# EAGLE design doodle with clock5  atmega328 3 (EAGLE 6.2)
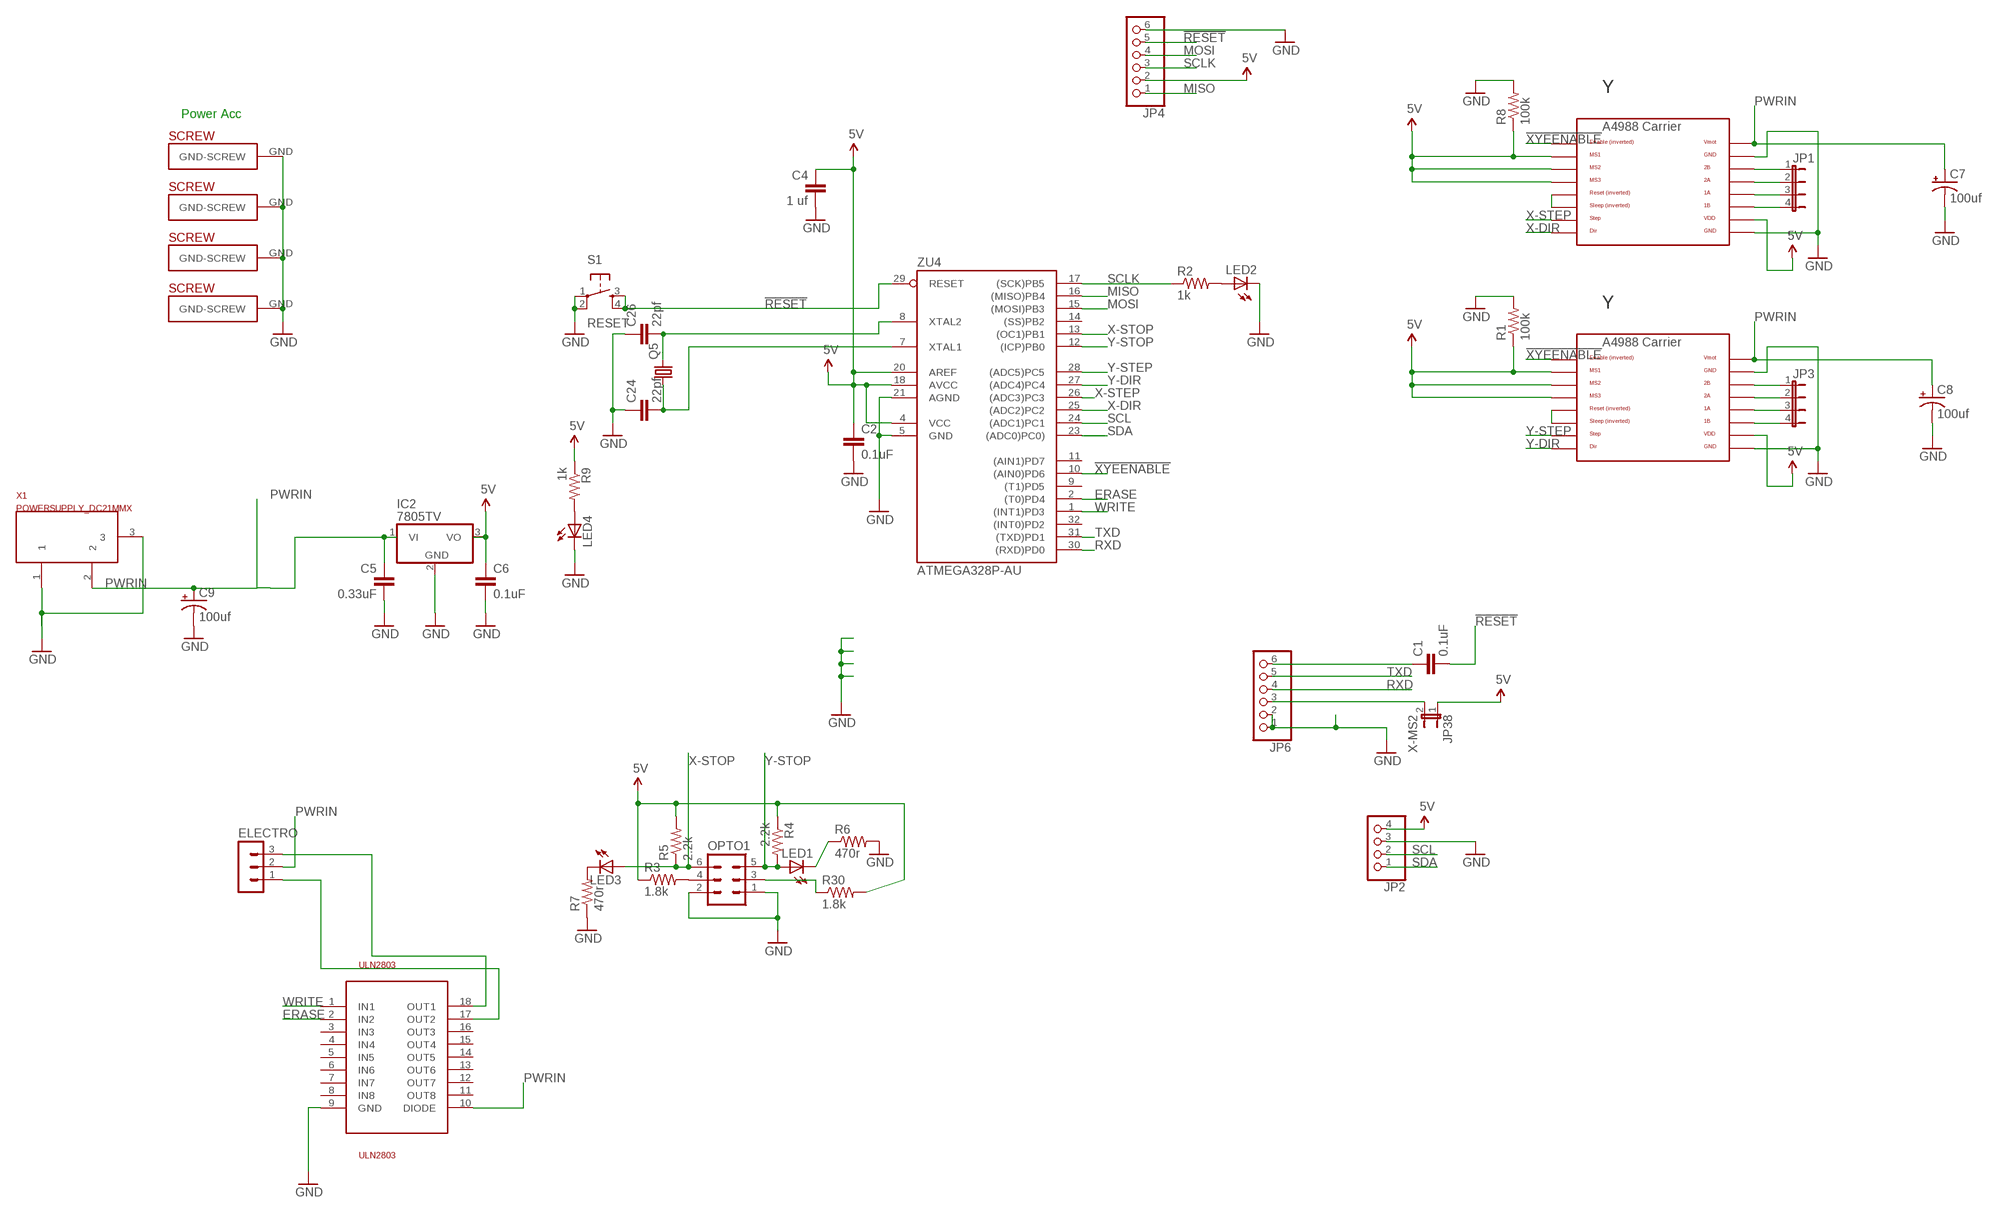
[diagram p0: schematic, sheet 1, part 1 of 2]
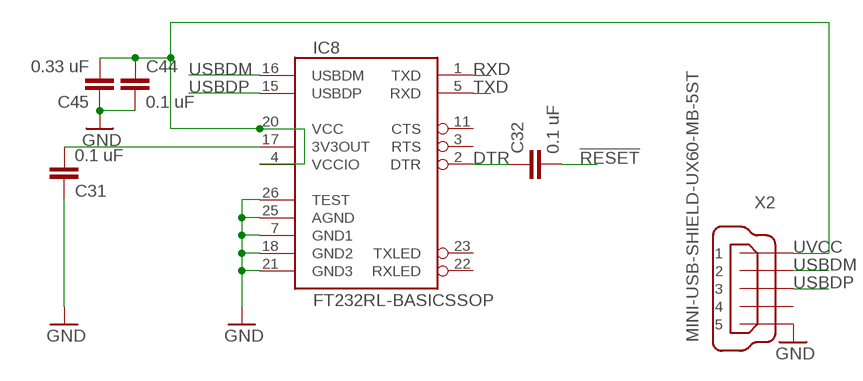
[diagram p1: schematic, sheet 1, part 2 of 2]

## Parts
C1  0.1uF  CAP0805  [0805]
C2  0.1uF  CAP0805  [0805]
C4  1 uf  CAP0805  [0805]
C5  0.33uF  CAPPTH2  [CAP-PTH-SMALL2]
C6  0.1uF  CAPPTH2  [CAP-PTH-SMALL2]
C7  100uf  CAP_POLPTH1  [CPOL-RADIAL-100UF-25V]
C8  100uf  CAP_POLPTH1  [CPOL-RADIAL-100UF-25V]
C9  100uf  CAP_POLPTH1  [CPOL-RADIAL-100UF-25V]
C24  22pf  CAP0805  [0805]
C26  22pf  CAP0805  [0805]
C31  0.1 uF  C-EUC1206  [C1206]
C32  0.1 uF  C-EUC1206  [C1206]
C44  0.1 uF  C-EUC1206  [C1206]
C45  0.33 uF  C-EUC1206  [C1206]
ELECTRO  MA03-1  [MA03-1]
IC2  7805TV  [TO220V]
IC8  FT232RL-BASICSSOP  [SSOP28DB]
JP1  JP4E  [JP4]
JP2  PINHD-1X4  [1X04]
JP3  JP4E  [JP4]
JP4  PINHD-1X6/90  [1X06/90]
JP6  PINHD-1X6  [1X06]
JP38  X-MS2  JUMPER-2PTH  [1X02]
LED1  LEDCHIPLED_0805  [CHIPLED_0805]
LED2  LEDCHIPLED_0805  [CHIPLED_0805]
LED3  LEDCHIPLED_0805  [CHIPLED_0805]
LED4  LEDCHIPLED_0805  [CHIPLED_0805]
OPTO1  MA03-2  [MA03-2]
Q5  CRYSTALHC49S  [HC49/S]
R1  100k  R-US_0207/7  [0207/7]
R2  1k  R-US_R0805  [R0805]
R3  1.8k  R-US_R0805  [R0805]
R4  2.2k  R-US_R0805  [R0805]
R5  2.2k  R-US_R0805  [R0805]
R6  470r  R-US_R0805  [R0805]
R7  470r  R-US_R0805  [R0805]
R8  100k  R-US_0207/7  [0207/7]
R9  1k  R-US_R0805  [R0805]
R30  1.8k  R-US_R0603  [R0603]
S1  RESET  TAC_SWITCHPTH  [TACTILE-PTH]
U$1  A4988BREAKOUT  [A4988BREAKOUT]
U$7  A4988BREAKOUT  [A4988BREAKOUT]
U$14  PLATED-SCREW  [PLATEDSCREW]
U$17  PLATED-SCREW  [PLATEDSCREW]
U$18  PLATED-SCREW  [PLATEDSCREW]
U$38  PLATED-SCREW  [PLATEDSCREW]
ULN2803  ULN2803  [SO18L]
X1  POWERSUPPLY_DC21MMX  [POWERSUPPLY_DC-21MM]
X2  MINI-USB-SHIELD-UX60-MB-5ST  [UX60-MB-5ST]
ZU4  ATMEGA328P-AU  [TQFP32-08]

## Nets
5V: C2.1 C4.1 C6.1 IC2.3(VO) JP2.4 JP4.2 JP38.1 R1.1 R3.1 R4.1 R5.2 R8.1 R9.1 R30.2 U$1.MS1 U$1.MS2 U$1.MS3 U$1.VDD U$7.MS1 U$7.MS2 U$7.MS3 U$7.VDD ZU4.4(VCC) ZU4.18(AVCC) ZU4.20(AREF)
!RESET: C1.2 C32.2 JP4.5 S1.3 S1.4 ZU4.29(RESET)
!XYEENABLE: U$1.EN U$7.EN ZU4.10((AIN0)PD6)
DTR: C32.1 IC8.2(DTR)
ERASE: ULN2803.2(IN2) ZU4.2((T0)PD4)
GND: C2.2 C4.2 C5.2 C6.2 C7.2(-) C8.2(-) C9.2(-) C24.1 C26.1 C31.1 C44.2 C45.1 IC2.2(GND) IC8.7(GND1) IC8.18(GND2) IC8.21(GND3) IC8.25(AGND) IC8.26(TEST) JP2.3 JP4.6 JP6.1 JP6.2 LED2.C LED4.C OPTO1.1 OPTO1.2 R1.2 R6.2 R7.1 R8.2 S1.1 S1.2 U$1.GND U$1.GND@0(GND) U$7.GND U$7.GND@0(GND) U$14.GND(GND-SCREW) U$17.GND(GND-SCREW) U$18.GND(GND-SCREW) U$38.GND(GND-SCREW) ULN2803.9(GND) X1.1 X1.3 X2.5 ZU4.5(GND) ZU4.21(AGND)
MISO: JP4.1 ZU4.16((MISO)PB4)
MOSI: JP4.4 ZU4.15((MOSI)PB3)
N$1: U$1.RST U$1.SLP(SLEEP)
N$2: JP3.1 U$1.2B
N$3: JP3.2 U$1.2A
N$4: JP3.3 U$1.1A
N$5: JP3.4 U$1.1B
N$6: ELECTRO.1 ULN2803.17(OUT2)
N$7: ELECTRO.3 ULN2803.18(OUT1)
N$8: OPTO1.4 R3.2
N$9: LED2.A R2.2
N$11: LED1.C R6.1
N$12: LED3.C R7.2
N$13: OPTO1.3 R30.1
N$14: JP1.1 U$7.2B
N$15: JP1.2 U$7.2A
N$16: JP1.3 U$7.1A
N$17: JP1.4 U$7.1B
N$18: C31.2 IC8.17(3V3OUT)
N$19: LED4.A R9.2
N$23: U$7.RST U$7.SLP(SLEEP)
N$70: C1.1 JP6.6
N$71: JP6.3 JP38.2
N$80: C26.2 Q5.2 ZU4.8(XTAL2)
N$81: C24.2 Q5.1 ZU4.7(XTAL1)
PWRIN [power]: C5.1 C7.1(+) C8.1(+) C9.1(+) ELECTRO.2 IC2.1(VI) U$1.VMOT U$7.VMOT ULN2803.10(DIODE) X1.2
RXD: IC8.1(TXD) JP6.4 ZU4.30((RXD)PD0)
SCL: JP2.2 ZU4.24((ADC1)PC1)
SCLK: JP4.3 R2.1 ZU4.17((SCK)PB5)
SDA: JP2.1 ZU4.23((ADC0)PC0))
TXD: IC8.5(RXD) JP6.5 ZU4.31((TXD)PD1)
USBDM: IC8.16(USBDM) X2.2
USBDP: IC8.15(USBDP) X2.3
UVCC [input]: C44.1 C45.2 IC8.4(VCCIO) IC8.20(VCC) X2.1
WRITE: ULN2803.1(IN1) ZU4.1((INT1)PD3)
X-DIR: U$7.DIR ZU4.25((ADC2)PC2)
X-STEP: U$7.STEP ZU4.26((ADC3)PC3)
X-STOP: LED3.A OPTO1.6 R5.1 ZU4.13((OC1)PB1)
Y-DIR: U$1.DIR ZU4.27((ADC4)PC4)
Y-STEP: U$1.STEP ZU4.28((ADC5)PC5)
Y-STOP: LED1.A OPTO1.5 R4.2 ZU4.12((ICP)PB0)
Unconnected: IC8.3(RTS) IC8.11(CTS) IC8.22(RXLED) IC8.23(TXLED) ULN2803.3(IN3) ULN2803.4(IN4) ULN2803.5(IN5) ULN2803.6(IN6) ULN2803.7(IN7) ULN2803.8(IN8) ULN2803.11(OUT8) ULN2803.12(OUT7) ULN2803.13(OUT6) ULN2803.14(OUT5) ULN2803.15(OUT4) ULN2803.16(OUT3) X2.4 X2.M1(S1) X2.M2(S2) X2.M3(S3) X2.M4(S4) ZU4.9((T1)PD5) ZU4.11((AIN1)PD7) ZU4.14((SS)PB2) ZU4.32((INT0)PD2)

## Notes on the sheet
- Y
- Power Acc
- Y

## Library data of the parts
C1 C2 C4-C6 C24 C26 = SparkFun:CAP: Capacitor Standard 0603 ceramic capacitor, and 0.1" leaded capacitor.
C7-C9 = SparkFun:CAP_POL: Capacitor Polarized These are standard SMD and PTH capacitors. Normally 10uF, 47uF, and 100uF in electrolytic and tantalum varieties. Always verify the external diameter of the through hole cap, it varies with capacity, voltage, and manufacturer. The EIA devices should be standard.
C31 C32 C44 C45 = rcl:C-EU: CAPACITOR, European symbol
ELECTRO = con-lstb:MA03-1: PIN HEADER; OC_FARNELL: unknown; OC_NEWARK: unknown
IC2 = linear:78*: Positive VOLTAGE REGULATOR Source: http://cache.national.com/ds/LM/LM78L05.pdf http://www.fairchildsemi.com/ds/LM/LM7805.pdf
IC8 = SparkFun:FT232RL-BASIC: USB UART This is the simplified version of the FT232RL unit. Only what you need, nothing you don't. Spark Fun Electronics SKU : COM-00650
JP1 JP3 = jumper:JP4E: JUMPER
JP2 = pinhead:PINHD-1X4: PIN HEADER
JP4 JP6 = pinhead:PINHD-1X6: PIN HEADER
JP38 = SparkFun:JUMPER-2: Jumper Basic 0.1" spaced jumper. Use with breakaway headers.
LED1-LED4 = led:LED: LED OSRAM: - CHIPLED LG R971, LG N971, LY N971, LG Q971, LY Q971, LO R971, LY R971 LH N974, LH R974 LS Q976, LO Q976, LY Q976 LO Q996 - Hyper CHIPLED LW Q18S LB Q993, LB Q99A, LB R99A - SideLED LS A670, LO A670, LY A670, LG A670, LP A670 LB A673, LV A673, LT A673, LW A673 LH A674 LY A675 LS A676, LA A676, LO A676, LY A676, LW A676 LS A679, LY A679, LG A679 - Hyper Micro SIDELED® LS Y876, LA Y876, LO Y876, LY Y876 LT Y87S - SmartLED LW L88C, LW L88S LB L89C, LB L89S, LG L890 LS L89K, LO L89K, LY L89K LS L896, LA L896, LO L896, LY L896 - TOPLED LS T670, LO T670, LY T670, LG T670, LP T670 LSG T670, LSP T670, LSY T670, LOP T670, LYG T670 LG T671, LOG T671, LSG T671 LB T673, LV T673, LT T673, LW T673 LH T674 LS T676, LA T676, LO T676, LY T676, LB T676, LH T676, LSB T676, LW T676 LB T67C, LV T67C, LT T67C, LS T67K, LO T67K, LY T67K, LW E67C LS E67B, LA E67B, LO E67B, LY E67B, LB E67C, LV E67C, LT E67C LW T67C LS T679, LY T679, LG T679 LS T770, LO T770, LY T770, LG T770, LP T770 LB T773, LV T773, LT T773, LW T773 LH T774 LS E675, LA E675, LY E675, LS T675 LS T776, LA T776, LO T776, LY T776, LB T776 LHGB T686 LT T68C, LB T68C - Hyper Mini TOPLED® LB M676 - Mini TOPLED Santana® LG M470 LS M47K, LO M47K, LY M47K Source: http://www.osram.convergy.de LUXEON: - LUMILED® LXK2-PW12-R00, LXK2-PW12-S00, LXK2-PW14-U00, LXK2-PW14-V00 LXK2-PM12-R00, LXK2-PM12-S00, LXK2-PM14-U00 LXK2-PE12-Q00, LXK2-PE12-R00, LXK2-PE12-S00, LXK2-PE14-T00, LXK2-PE14-U00 LXK2-PB12-K00, LXK2-PB12-L00, LXK2-PB12-M00, LXK2-PB14-N00, LXK2-PB14-P00, LXK2-PB14-Q00 LXK2-PR12-L00, LXK2-PR12-M00, LXK2-PR14-Q00, LXK2-PR14-R00 LXK2-PD12-Q00, LXK2-PD12-R00, LXK2-PD12-S00 LXK2-PH12-R00, LXK2-PH12-S00 LXK2-PL12-P00, LXK2-PL12-Q00, LXK2-PL12-R00 Source: www.luxeon.com KINGBRIGHT: KA-3528ASYC Source: www.kingbright.com
OPTO1 = con-lstb:MA03-2: PIN HEADER; OC_FARNELL: unknown; OC_NEWARK: unknown
Q5 = crystal:CRYSTAL: CRYSTAL; OC_FARNELL: 1667008; OC_NEWARK: unknown
R1 R8 = adafruit:R-US_: RESISTOR, American symbol
R2-R7 R9 R30 = resistor:R-US_: RESISTOR, American symbol
S1 = SparkFun:TAC_SWITCH: Momentary Switch Button commonly used for reset or general input. Spark Fun Electronics SKU : COM-00097
U$1 U$7 = RepRapjr:A4988BREAKOUT
U$14 U$17 U$18 U$38 = Sanguinololu:PLATED-SCREW
ULN2803 = uln2803:ULN2803
X1 = SmartPrj:POWERSUPPLY_DC21MM
X2 = con-hirose:MINI-USB-SHIELD-: MINI USB Connector Source: http://www.hirose.co.jp/cataloge_hp/e24000019.pdf; OC_FARNELL: unknown; OC_NEWARK: unknown
ZU4 = SmartPrj:ATMEGA328P-: MICROCONTROLLER 4 Kbytes FLASH 128 bytes SRAM 256 bytes EEPROM UART 6-channel 10 bit ADC

## Net classes
0 default: width 0.254 mm, clearance 0.254 mm
3 usbvcc: width 0.508 mm, drill 0.61 mm, clearance 0.254 mm

## Board
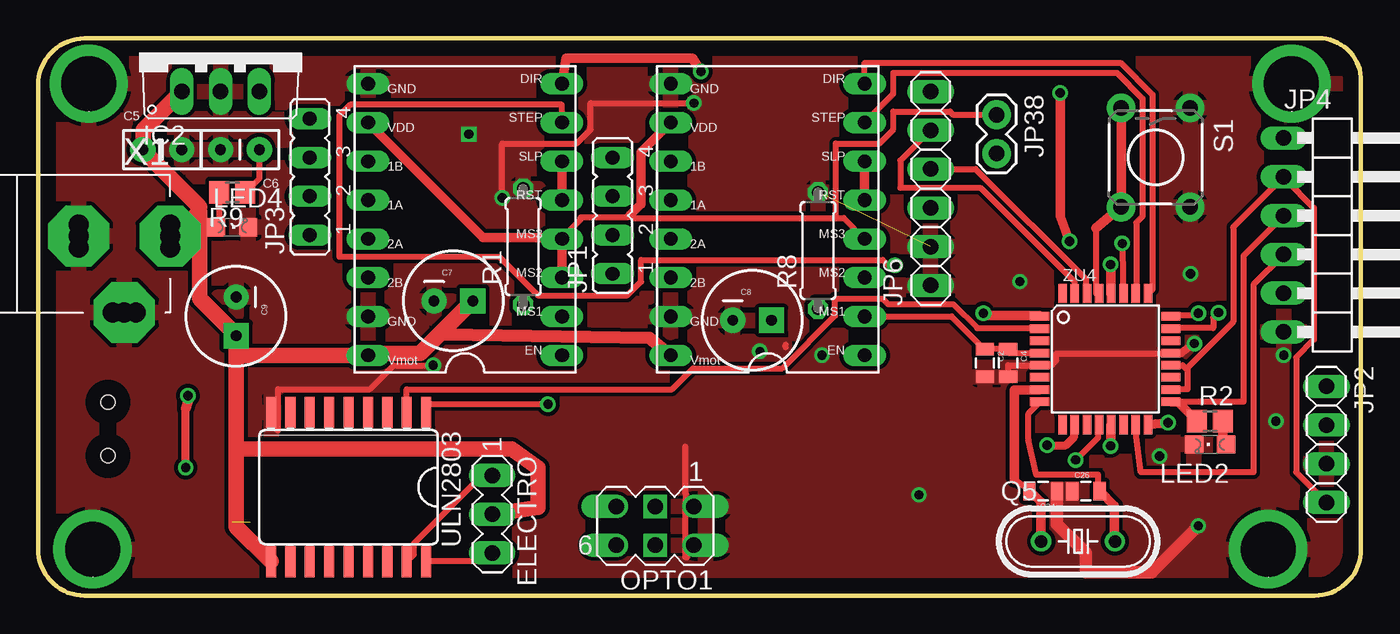
[diagram p2: board, top side]
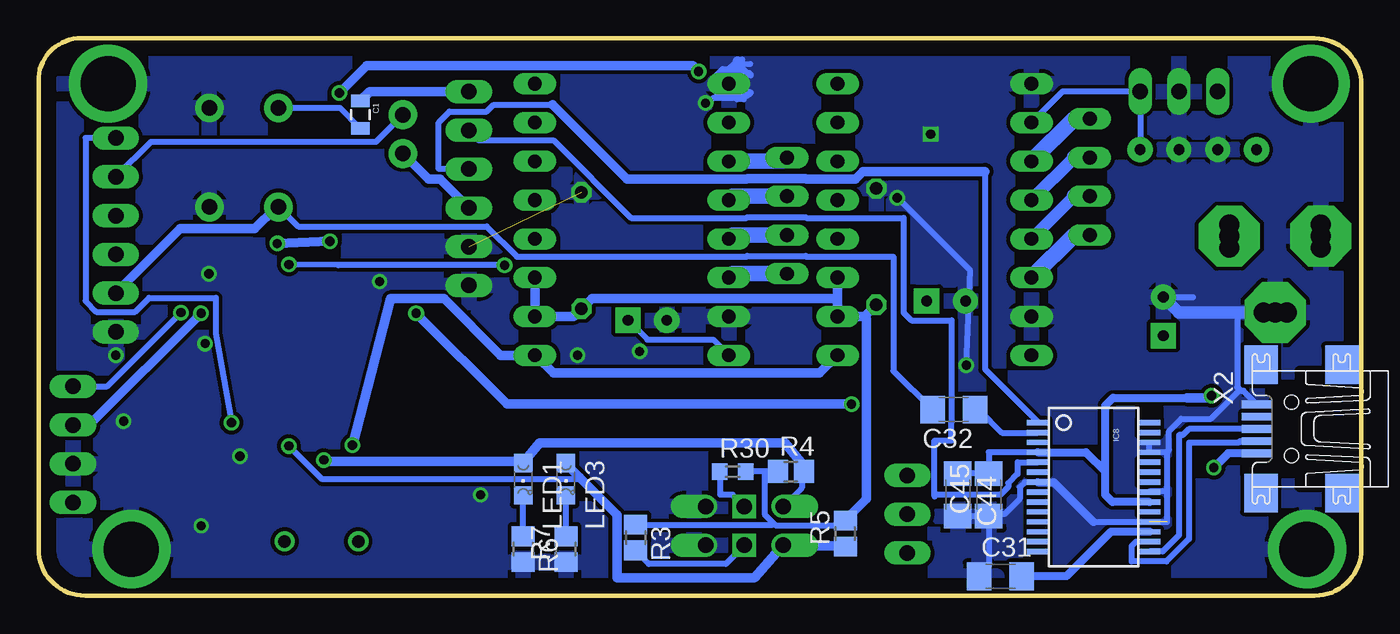
[diagram p3: board, bottom side, seen from below]

Size 86.59 x 36.51 mm. Coordinates in mm from the lower left corner, seen from the top.
Outline: 0,33.45 0,3.05 arc90 3.05,0 83.55,0 arc90 86.59,3.05 86.59,33.96 arc90 83.55,36.5 3.05,36.5 arc90 0,33.45
Copper layers (1*16): Top 0.035mm / dielectric 1.5mm / Bottom 0.035mm
Design rules: minimum track width 15mil, minimum drill 24mil, track to track 8mil, track to pad 8mil, pad to pad 8mil, via to via 8mil, smd to smd 8mil, copper to edge 40mil, drill to drill 8mil, minimum pad ring 10mil, minimum via ring 8mil, stop-mask expansion 4mil, vias tented up to drill 0mil, thermal gap 10mil

### Footprints (pad centres in the part's own frame; a part is rotated, then mirrored left to right if it is on the bottom)
0805 = smd 0.8 x 1.2: 1 -0.9,0; 2 0.9,0
CAP-PTH-SMALL2 = drill 0.7 pad 1.651: 1 0,0; 2 2.54,0
CPOL-RADIAL-100UF-25V = drill 0.7 pad 1.651 square: 1 1.27,0 | drill 0.7 pad 1.651: 2 -1.27,0
C1206 = smd 1.6 x 1.8: 1 -1.4,0; 2 1.4,0
MA03-1 = drill 1.016 long: 1 -2.54,0; 2 0,0; 3 2.54,0
TO220V = drill 1.016 long: 1 -2.54,-2.54; 2 0,-2.54; 3 2.54,-2.54
SSOP28DB = smd 0.348 x 1.397: 1 -4.225,-3.656; 2 -3.575,-3.656; 3 -2.925,-3.656; 4 -2.275,-3.656; 5 -1.625,-3.656; 6 -0.975,-3.656; 7 -0.325,-3.656; 8 0.325,-3.656; 9 0.975,-3.656; 10 1.625,-3.656; 11 2.275,-3.656; 12 2.925,-3.656; 13 3.575,-3.656; 14 4.225,-3.656; 15 4.225,3.656; 16 3.575,3.656; 17 2.925,3.656; 18 2.275,3.656; 19 1.625,3.656; 20 0.975,3.656; 21 0.325,3.656; 22 -0.325,3.656; 23 -0.975,3.656; 24 -1.625,3.656; 25 -2.275,3.656; 26 -2.925,3.656; 27 -3.575,3.656; 28 -4.225,3.656
JP4 = drill 0.914 long: 1 -3.81,0; 2 -1.27,0; 3 1.27,0; 4 3.81,0
1X04 = drill 1.016 long: 1 -3.81,0; 2 -1.27,0; 3 1.27,0; 4 3.81,0
1X06/90 = drill 1.016 long: 1 -6.35,-3.81; 2 -3.81,-3.81; 3 -1.27,-3.81; 4 1.27,-3.81; 5 3.81,-3.81; 6 6.35,-3.81
1X06 = drill 1.016 long: 1 -6.35,0; 2 -3.81,0; 3 -1.27,0; 4 1.27,0; 5 3.81,0; 6 6.35,0
1X02 = drill 1.016 pad 1.88: 1 0,0; 2 2.54,0
CHIPLED_0805 = smd 1.2 x 1.2: A 0,-1.05; C 0,1.05
MA03-2 = drill 1.016 offset: 1 -2.54,-1.27; 2 -2.54,1.27; 5 2.54,-1.27; 6 2.54,1.27 | drill 1.016 square: 3 0,-1.27; 4 0,1.27
HC49/S = drill 0.813: 1 -2.413,0; 2 2.413,0
0207/7 = drill 0.813 octagon: 1 -3.81,0; 2 3.81,0
R0805 = smd 1.3 x 1.5: 1 -0.85,0; 2 0.85,0
R0603 = smd 1 x 1.1: 1 -0.85,0; 2 0.85,0
TACTILE-PTH = drill 1.016 pad 1.88: 1 -3.251,2.261; 2 3.251,2.261; 3 -3.251,-2.261; 4 3.251,-2.261
A4988BREAKOUT = drill 0.9 long: 1A 8.89,1.27; 1B 11.43,1.27; 2A 6.35,1.27; 2B 3.81,1.27; DIR 16.51,-11.43; EN -1.27,-11.43; GND 16.51,1.27; GND@0 1.27,1.27; MS1 1.27,-11.43; MS2 3.81,-11.43; MS3 6.35,-11.43; RST 8.89,-11.43; SLP 11.43,-11.43; STEP 13.97,-11.43; VDD 13.97,1.27; VMOT -1.27,1.27
PLATEDSCREW = drill 3.6: GND 0,0
SO18L = smd 0.66 x 2.032: 1 -5.08,-4.902; 2 -3.81,-4.902; 3 -2.54,-4.902; 4 -1.27,-4.902; 5 0,-4.902; 6 1.27,-4.902; 7 2.54,-4.902; 8 3.81,-4.902; 9 5.08,-4.902; 10 5.08,4.902; 11 3.81,4.902; 12 2.54,4.902; 13 1.27,4.902; 14 0,4.902; 15 -1.27,4.902; 16 -2.54,4.902; 17 -3.81,4.902; 18 -5.08,4.902
POWERSUPPLY_DC-21MM = drill 1.3 pad 4 octagon: 1 -5.08,-3.353; 2 -0.076,-6.35; 3 -0.076,-0.356 | drill 1.3: 4 -5.08,-4.115; 5 -5.08,-2.591; 6 -0.838,-0.356; 7 0.686,-0.356; 8 -0.838,-6.35; 9 0.686,-6.35
UX60-MB-5ST = smd 2 x 0.5: 1 2.25,1.6; 2 2.25,0.8; 3 2.25,0; 4 2.25,-0.8; 5 2.25,-1.6 | smd 2.2 x 2.5: M1 -3.3,-4.2; M2 -3.3,4.2; M3 2,4.2; M4 2,-4.2 | hole 0.9: 0,-1.75; 0,1.75
TQFP32-08 = smd 1.27 x 0.559: 1 -4.293,2.8; 2 -4.293,2; 3 -4.293,1.2; 4 -4.293,0.4; 5 -4.293,-0.4; 6 -4.293,-1.2; 7 -4.293,-2; 8 -4.293,-2.8; 17 4.293,-2.8; 18 4.293,-2; 19 4.293,-1.2; 20 4.293,-0.4; 21 4.293,0.4; 22 4.293,1.2; 23 4.293,2; 24 4.293,2.8 | smd 0.559 x 1.27: 9 -2.8,-4.293; 10 -2,-4.293; 11 -1.2,-4.293; 12 -0.4,-4.293; 13 0.4,-4.293; 14 1.2,-4.293; 15 2,-4.293; 16 2.8,-4.293; 25 2.8,4.293; 26 2,4.293; 27 1.2,4.293; 28 0.4,4.293; 29 -0.4,4.293; 30 -1.2,4.293; 31 -2,4.293; 32 -2.8,4.293

### Placement (x,y rotation side)
C1  65.53,31.5 270 bottom
C2  61.98,15.24 270 top
C4  63.5,15.24 270 top
C5  6.86,29.21 0 top
C6  14.48,29.21 180 top
C7  27.18,19.3 0 top
C8  46.74,18.03 0 top
C9  12.95,18.29 270 top
C24  65.79,6.86 180 top
C26  68.58,6.86 0 top
C31  23.62,1.27 0 bottom
C32  26.67,12.19 180 bottom
C44  26.42,6.6 270 bottom
C45  24.38,6.6 90 bottom
ELECTRO  29.72,5.33 270 top
IC2  11.94,35.56 0 top
IC8  17.53,7.11 270 bottom
JP1  37.59,24.89 90 top
JP2  84.33,9.91 270 top
JP3  17.78,27.43 90 top
JP4  85.34,23.62 270 top
JP6  58.42,26.67 90 top
JP38  62.74,31.5 270 top
LED1  54.86,7.62 180 bottom
LED2  76.71,9.91 90 top
LED3  52.07,7.62 180 bottom
LED4  12.7,24.13 270 top
OPTO1  40.39,4.57 180 top
Q5  68.07,3.56 0 top
R1  31.75,22.86 90 top
R2  76.71,11.43 0 top
R3  47.5,3.81 270 bottom
R4  37.34,8.13 0 bottom
R5  33.78,4.06 90 bottom
R6  54.86,3.05 270 bottom
R7  52.07,3.05 90 bottom
R8  51.05,22.61 90 top
R9  12.7,26.42 180 top
R30  41.15,8.13 0 bottom
S1  73.15,28.7 270 top
U$1  22.86,17.02 90 top
U$7  42.67,17.02 90 top
U$14  3.3,33.53 0 top
U$17  3.56,3.05 0 top
U$18  80.52,3.05 0 top
U$38  82.04,33.53 0 top
ULN2803  20.32,7.11 180 top
X1  2.29,23.62 90 top
X2  4.57,10.92 180 bottom
ZU4  69.85,15.49 0 top

### Tracks (layer width: path | path; a pad name or v marks a point on that pad's centre or on a via)
5V
  Top 0.381: 75.16,14.86 74.93,15.09 74.17,15.09 ZU4.20 | 75.16,14.86 75.23,14.78 75.23,13.51 74.17,13.51 ZU4.18 | 75.16,14.86 78.23,17.93 78.23,24.13 JP4.2 81.64,27.28 83.52,25.4 83.52,16.76 82.35,15.6 82.35,8.08 JP2.4 | ZU4.4 65.53,15.9 63.55,15.9 63.55,15.95 C4.1 63.5,16.15 61.98,16.15 C2.1 61.82,16.26 59.79,18.29 U$7.MS1 | C6.1 14.48,27.33 13.56,26.42 R9.1 | U$7.MS3 52.73,24.74 52.22,24.74 | 52.22,24.74 38.86,24.74 38.86,24.79 38.73,24.92 38.61,24.79 35.51,24.79 35.51,24.64 34.39,23.52 U$1.MS3 34.14,23.47 | JP38.1 59.89,31.5 59.69,31.7 55.98,31.7 55.98,30.53 55.07,29.62 52.22,29.62 52.22,24.74
  Top 0.61: U$1.MS2 U$1.MS3 | U$7.VDD 39.47,29.06 39.47,25.65 38.73,24.92 | U$1.VDD 29.11,23.47 34.14,23.47
  Bottom 0.381: 51.56,18.29 R8.1 50.9,18.9 | U$1.VDD 19.56,33.02 IC2.3 C6.1 | R4.1 39.07,8.13 | 39.07,8.13 R30.2 | 38.48,4.75 39.07,5.33 39.07,8.13 | 38.48,4.75 38.35,4.62 34.04,4.62 33.78,4.88 R5.2 33.68,5.08 | R3.1 47.5,4.62 38.61,4.62 38.48,4.75 | 32.41,18.14 32.51,18.29 | JP4.2 79.25,29.72 64.52,29.72 JP38.1
  Bottom 0.61: 51.56,18.29 U$7.MS1 U$7.MS2 | R1.1 32.51,18.29 U$1.MS1 34.29,19.46 | 34.29,19.46 U$1.MS2 | 33.68,5.08 32.41,6.35 32.41,18.14 | 50.9,18.9 50.34,19.46 34.29,19.46
!RESET
  Top 0.381: 69.24,24.08 69.24,19.81 ZU4.29 | 70.87,25.45 S1.4 70.92,25.6 | 70.92,31.95 S1.3
  Top 0.61: 70.87,25.45 69.24,24.08 | 70.92,25.6 70.92,31.95
  Bottom 0.381: S1.3 66.85,31.95 65.53,30.63 C1.2 | C32.2 28.09,12.19 30.63,14.73 30.63,22.2 36.32,22.2 36.37,22.25 40.18,22.25 40.23,22.2 55.27,22.2 57.25,24.18 69.6,24.18 70.87,25.45 S1.4 71.07,25.4
  Bottom 0.61: JP4.5 77.32,24.03 72.44,24.03 71.07,25.4
!XYEENABLE  (via drill 0.61)
  Top 0.381: 67.82,11.23 ZU4.10
  Top 0.508: v66.04,9.86 67.26,9.86 67.82,10.41 67.82,11.17 ZU4.10
  Bottom 0.381: 53.95,15.65 U$7.EN
  Bottom 0.61: v66.04,9.86 63.55,19.46 60.05,19.46 56.34,15.75 U$7.EN | U$1.EN 35.46,14.58 52.88,14.58 53.95,15.65
DTR
  Bottom 0.381: C32.1 25.04,12.19 23.52,10.67 21.18,10.67 IC8.2
ERASE
  Top 0.381: ULN2803.2 24.13,13.51 41.5,13.51 42.88,14.88 48.72,14.88 52.17,18.34 52.17,19.46 55.27,19.46 55.63,19.1 59.89,19.1 61.47,17.53 65.53,17.53 ZU4.2
GND  (via drill 0.6, 0.61)  (2 unrouted)
  Top 0.381: C4.2 63.5,15.09 65.53,15.09 ZU4.5 65.73,15.14 66.4,15.14 66.65,15.39 66.65,15.85 74.12,15.85 ZU4.21 | v42.93,32.26 36.17,32.26 36.17,30.53 35.26,29.62 30.38,29.62 v30.38,26.06 | v25.86,15.09 23.27,15.09 21.69,13.51 15.7,13.51 15.7,10.82 | 42.37,9.75 42.37,6.71 42.42,6.66 42.42,6.1 42.37,6.04 42.37,2.54 42.42,2.49 42.47,2.49 42.47,3 42.42,3.05 42.42,3.1 OPTO1.2 | 48.92,16.26 48.92,16.45
  Top 0.508: ZU4.21 74.82,15.89 v75.69,16.51
  Top 0.813: C24.1 66.69,4.69 68.58,2.79 68.58,1.52 72.9,1.52 v75.95,4.57
  Bottom 0.381: C9.2 11.02,19.56 | v42.93,32.26 42.77,32.26 42.42,32.61 40.84,32.61 40.79,32.56 40.44,32.56 40.44,32.51 40.84,32.51 40.84,32.56 40.79,32.61 40.39,32.61 40.39,32.66 41.76,32.66 41.76,32.72 40.84,32.72 40.79,32.77 40.23,32.77 40.23,32.72 40.79,32.72 40.84,32.77 41.96,32.77 41.96,32.82 40.08,32.82 40.08,32.87 42.16,32.87 42.16,32.92 42.11,32.97 41.71,32.97 41.71,33.02 41.76,33.07 42.22,33.07 42.22,33.02 42.11,32.92 39.98,32.92 39.98,32.97 41.61,32.97 41.86,33.22 42.27,33.22 42.27,33.27 41.91,33.27 41.91,33.33 42.32,33.33 42.32,33.38 41.91,33.38 41.91,33.43 42.32,33.43 42.32,33.48 41.91,33.48 41.91,33.53 42.32,33.53 42.32,33.58 41.91,33.58 41.91,33.63 42.32,33.63 42.32,33.68 41.91,33.68 41.91,33.73 42.32,33.73 42.32,33.78 41.91,33.78 41.91,33.83 42.27,33.83 42.27,33.88 41.81,33.88 41.81,33.93 42.22,33.93 42.27,33.98 42.27,34.04 41.81,34.49 41.45,34.49 41.4,34.44 40.39,34.44 40.39,34.39 41.66,34.39 41.66,34.34 40.28,34.34 40.28,34.29 41.91,34.29 41.91,34.24 40.08,34.24 40.08,34.19 42.01,34.19 42.01,34.14 39.98,34.14 39.98,34.09 41.61,34.09 41.71,33.98 42.22,33.98 42.22,34.04 41.91,34.34 41.81,34.34 41.76,34.39 41.71,34.39 41.66,34.44 41.45,34.44 40.95,34.95 40.95,35.05 40.89,35.1 40.84,35.1 40.79,35.05 40.59,35.05 40.59,35 40.84,35 40.84,35.05 40.79,35.1 40.54,35.1 40.54,34.95 40.59,34.9 40.95,34.9 40.95,34.85 40.89,34.8 40.49,34.8 40.01,34.82 | v30.38,26.06 25.6,21.29 v25.86,15.09 | 7.95,13.49 8.13,13.66 8.13,18.54 | 7.95,13.49 7.87,13.41 7.72,13.41 6.86,12.55 X2.5 | 7.95,13.49 9.86,11.58 11.79,11.58 12.6,10.77 12.6,9.55 12.7,9.4
  Bottom 0.406: 17.53,4.83 12.7,4.83 12.7,6.86 | IC8.21 13.8,6.86 12.7,6.86 | 12.7,6.86 12.7,9.4 IC8.25 IC8.26 | IC8.7 22.03,7.44 22.35,7.11 22.35,6.35 23.37,5.33 24.25,5.33 C45.1 | C45.1 C44.2 | C45.1 24.38,1.91 C31.1
  Bottom 0.508: IC8.7 20.14,7.44 17.53,4.83
  Bottom 0.813: X1.1 8.13,18.54 11.94,18.54 C9.2
  other vias: 28.19,30.23 75.44,21.08 81.53,15.75 81.03,11.43 64.26,20.57 57.66,6.6 73.41,9.14 51.31,15.75 47.24,16
  pour Bottom (isolate 0.254): 3.01,37.5 84.96,37.5 arc-90 88.01,34.45 88.01,2.5 88.01,1.8 arc-90 84.96,-1.25 3.01,-1.25 2.31,-1.25 arc-90 -0.74,1.8 -0.74,33.75 -0.74,34.45 arc-90 2.31,37.5
  pour Top: 3.01,37.5 84.96,37.5 arc-90 88.01,34.45 88.01,32.5 88.01,1.8 arc-90 84.96,-1.25 83.01,-1.25 2.31,-1.25 arc-90 -0.74,1.8 -0.74,33.75 -0.74,34.45 arc-90 2.31,37.5
MISO  (via drill 0.61)
  Top 0.381: 72.69,11.23 ZU4.16
  Top 0.61: v73.96,11.33 72.69,11.23
  Bottom 0.381: v73.96,11.33 74.98,17.17 74.98,19.51 79.35,19.51 80.26,18.59 82.8,18.59 83.52,19.3 83.52,29.97 JP4.1
MOSI
  Top 0.381: JP4.4 79.55,20.37 79.55,8.08 72.19,8.08 71.88,10.41 71.88,11.18 ZU4.15
N$1
  Top 0.61: U$1.SLP U$1.RST
N$2
  Bottom 1.016: U$1.2B 18.8,23.62 JP3.1
N$3
  Bottom 0.813: 18.8,26.16 U$1.2A
  Bottom 1.016: JP3.2 18.8,26.16
N$4
  Bottom 0.813: 18.8,28.7 U$1.1A
  Bottom 1.016: JP3.3 18.8,28.7
N$5
  Bottom 1.016: U$1.1B 18.8,31.24 JP3.4
N$6
  Top 0.381: ELECTRO.1 29.06,7.87 24.59,3.4 24.59,2.69 24.13,2.23 ULN2803.17
N$7
  Top 0.381: ELECTRO.3 29.72,2.23 25.4,2.23 ULN2803.18
N$8
  Bottom 0.381: OPTO1.4 41.61,2.08 46.63,2.08 47.5,2.95 R3.2
N$9
  Top 0.61: R2.2 77.56,10.11 LED2.A
N$11
  Bottom 0.381: R6.1 LED1.C
N$12
  Bottom 0.381: R7.2 LED3.C
N$13
  Bottom 0.381: OPTO1.3 41.15,6.6 41.96,6.6 41.96,8.13 R30.1
N$14
  Bottom 1.016: U$7.2B 41.15,21.08 JP1.1
N$15
  Bottom 1.016: U$7.2A 41.15,23.62 JP1.2
N$16
  Bottom 1.016: U$7.1A 41.15,26.16 JP1.3
N$17
  Bottom 1.016: U$7.1B 37.85,28.45 JP1.4
N$18
  Bottom 0.508: IC8.17 16.39,4.19 19.3,1.27 C31.2
N$19
  Top 0.381: LED4.A 11.68,24.13 11.84,24.28 11.84,26.42 R9.2
N$23
  Top 0.61: U$7.SLP U$7.RST
N$70
  Bottom 0.381: C1.1
  Bottom 0.61: C1.1 64.92,33.02 JP6.6
N$71
  Bottom 0.61: JP6.3 60.3,27.28 61.06,27.28 JP38.2
N$80
  Top 0.381: 69.49,6.86 C26.2 69.39,7.01 69.39,7.92 65.33,7.92 64.82,10.21 64.82,11.94 65.53,12.65 ZU4.8 | 70.46,3.56 Q5.2
  Top 0.61: 69.49,6.86 70.46,5.89 70.46,3.56
N$81
  Top 0.381: 64.92,6.86 C24.2 64.77,7.01 63.91,7.62 | 65.63,3.56 Q5.1 | 65.53,13.46 ZU4.7
  Top 0.61: 64.92,6.86 65.63,6.15 65.63,3.56 | 65.53,13.46 63.91,13.46 63.91,7.62
PWRIN
  Top 0.381: 15.24,2.23 ULN2803.10 | 21.74,15.85 U$1.VMOT | 10.57,25.15 10.57,25.45 | 6.96,29.06 C5.1 | 12.85,17.17 C9.1 | 26.52,17.12 26.39,17.25
  Top 0.813: U$7.VMOT 40.03,16.87 26.52,17.12
  Top 1.016: IC2.1 6.86,30.48 C5.1 | 15.24,2.23 12.95,4.52 12.95,9.6 | C9.1 12.95,15.75 | 12.95,15.75 12.95,9.6 | 12.95,15.75 U$1.VMOT | ELECTRO.2 32.72,5.79 32.72,8.38 30.99,9.6 12.95,9.6 | C7.1 26.39,17.25 24.99,15.85 21.74,15.85 | 10.57,25.45 6.96,29.06 | 12.85,17.17 10.57,19.46 10.57,25.15 8.97,23.55 X1.2
  Bottom 0.381: U$7.VMOT 42.42,16.76 46.74,16.76 C8.1
RXD
  Top 0.381: JP6.4 61.37,27.94 68.58,20.73 68.58,19.86 68.63,19.81 ZU4.30
  Bottom 0.381: 24.64,27.79 24.64,14.83 21.18,11.38 IC8.1 | 36.37,27.33 36.32,27.28 | 40.23,27.28 40.18,27.33 | 52.93,32.16 56.79,32.16 57.25,31.7 59.69,31.7 60.4,30.99 60.4,27.94 JP6.4
  Bottom 0.61: 24.64,27.79 32.61,27.79 33.12,27.28 36.32,27.28 | 40.18,27.33 36.37,27.33 | 40.23,27.28 48.06,27.28 52.93,32.16
SCL  (via drill 0.61)
  Top 0.381: v75.95,18.49 75.95,18.34 74.17,18.34 ZU4.24
  Bottom 0.61: v75.95,18.49 83.26,11.18 JP2.2
SCLK
  Top 0.381: JP4.3 78.89,22.25 78.89,12.7 74.17,12.7 ZU4.17
  Top 0.61: 74.17,12.7 74.59,12.7 R2.1
SDA  (via drill 0.61)
  Top 0.381: v77.27,18.54 76.91,18.19 76.91,17.53 74.17,17.53 ZU4.23
  Bottom 0.381: v77.27,18.54 82.09,13.72 JP2.1
TXD
  Top 0.381: JP6.5 56.44,28.5 56.44,26.72 61.67,26.72 67.82,20.57 67.82,19.81 ZU4.31
  Bottom 0.381: 22.5,8.74 IC8.5 | 26.82,11.38 26.82,18.03 29.46,18.03 29.97,18.54 29.97,24.74 36.32,24.74 36.37,24.79 40.18,24.79 40.23,24.74 47.8,24.74 52.88,29.82 57.76,29.82 JP6.5
  Bottom 0.406: 27.94,6.5 27.94,6.6 | 27.94,6.6 27.94,10.16 26.82,10.16 26.82,11.38 | 22.5,8.74 22.5,7.98 23.11,7.37 23.11,7.11 23.62,6.6 27.94,6.6
USBDM
  Bottom 0.381: IC8.16 13.92,3.56 14.73,3.56 15.04,3.25 15.04,2.23 12.75,2.23 11.28,3.71 11.28,10.01 8.03,10.01 7.92,10.11 6.86,10.11 X2.2
USBDP
  Bottom 0.381: X2.3 11.28,10.92 11.68,10.52 11.94,10.52 11.94,3.96 13,2.9 IC8.15
UVCC  (via drill 0.6, 0.61)
  Top 0.508: v9.65,8.38 9.65,12.24
  Top 0.61: 9.65,12.24 9.8,12.75 v9.8,13.11
  Bottom 0.381: IC8.20
  Bottom 0.406: IC8.4 24.38,9.39 | 24.38,9.39 24.38,9.4 | 24.38,9.39 C45.2 C44.1
  Bottom 0.508: X2.1 8.71,9.32 v9.65,8.38 | IC8.20 16.3,6.14 16.76,6.6 16.76,8.13 | 16.76,8.13 16.76,12.45 16.26,12.95 11.43,12.95 | IC8.4 18.02,9.39 16.76,8.13
  Bottom 0.61: 11.43,12.95 9.96,12.95 v9.8,13.11
WRITE  (via drill 0.61)
  Top 0.381: v33.38,12.55 25.4,12.55 ULN2803.1 | 65.53,18.34 ZU4.1
  Top 0.61: 65.53,18.34 61.87,18.34 v61.87,18.49
  Bottom 0.61: v61.87,18.49 55.93,12.55 v33.38,12.55
X-DIR
  Top 0.381: U$7.DIR 54.1,34.9 70.87,34.9 72.95,32.82 72.95,20.07 72.69,19.81 ZU4.25
X-STEP
  Top 0.381: U$7.STEP 55.98,32.87 55.98,34.24 70.61,34.24 72.29,32.56 72.29,24.84 71.88,24.43 71.88,19.81 ZU4.26
X-STOP  (via drill 0.61)
  Top 0.381: 70.21,11.18 ZU4.13
  Top 0.61: v70.21,9.8 70.21,11.18
  Bottom 0.381: 52.07,8.64 LED3.A | v70.21,9.8 68.02,7.62 51.31,7.62 51.18,7.75 | 33.78,3.25 R5.1
  Bottom 0.61: 52.07,8.64 51.18,7.75 48.72,5.28 48.72,1.17 39.73,1.17 OPTO1.6 37.69,3.25 33.78,3.25
Y-DIR  (via drill 0.61)
  Top 0.381: v70.97,23.06 71.02,20.73 71.02,19.81 ZU4.27
  Top 0.61: v67.51,23.22 66.9,24.84 v66.9,32.92 | v43.38,34.34 43.18,34.59 42.82,35.2 34.54,35.2 U$1.DIR
  Bottom 0.61: v67.51,23.22 v70.97,23.06 | v66.9,32.92 65.13,34.7 43.74,34.7 v43.38,34.34
Y-STEP  (via drill 0.61)
  Top 0.381: v56.08,21.64 55.63,21.64 55.27,22 39.47,22 39.47,20.57 38.56,19.66 32.72,19.66 30.18,22.2 19.71,22.2 19.71,31.45 20.42,32.16 34.29,32.16 U$1.STEP | 70.21,19.76 ZU4.28
  Top 0.61: v70.21,21.69 70.21,19.76
  Bottom 0.381: v70.21,21.69 66.95,21.64 v56.08,21.64
Y-STOP  (via drill 0.61)
  Top 0.381: v67.92,8.89 69.39,10.36 69.39,11.12 69.44,11.18 ZU4.12
  Bottom 0.381: 36.53,8.53 36.53,8.13 R4.2 36.63,7.98 36.63,7.06 OPTO1.5 | 54.86,8.69 LED1.A 55.02,8.79 | 67.82,8.79 v67.92,8.89
  Bottom 0.61: 54.86,8.69 53.8,10.01 37.74,10.01 36.53,8.53 | 55.02,8.79 67.82,8.79